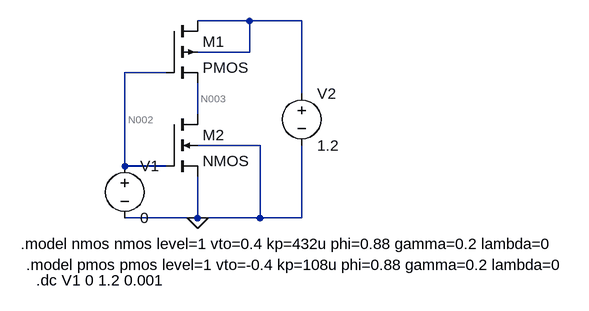
[diagram p0: schematic Lab03Pt4.asc]
Lab03Pt4.asc, the LTspice schematic file:
Version 4
SHEET 1 880 680
WIRE 272 -32 192 -32
WIRE 352 -32 272 -32
WIRE 272 16 272 -32
WIRE 272 16 192 16
WIRE 144 48 80 48
WIRE 352 80 352 -32
WIRE 192 112 192 64
WIRE 288 160 192 160
WIRE 80 192 80 48
WIRE 144 192 80 192
WIRE 192 272 192 208
WIRE 192 272 80 272
WIRE 288 272 288 160
WIRE 288 272 192 272
WIRE 352 272 352 160
WIRE 352 272 288 272
FLAG 192 272 0
SYMBOL voltage 80 176 R0
WINDOW 123 0 0 Left 0
WINDOW 39 0 0 Left 0
SYMATTR InstName V1
SYMATTR Value 0
SYMBOL voltage 352 64 R0
WINDOW 123 0 0 Left 0
WINDOW 39 0 0 Left 0
SYMATTR InstName V2
SYMATTR Value 1.2
SYMBOL pmos4 144 -32 R0
SYMATTR InstName M1
SYMATTR Value2 l=0.1u w=8u
SYMBOL nmos4 144 112 R0
SYMATTR InstName M2
SYMATTR Value2 l=0.1u w=2u
TEXT -80 312 Left 2 !.model nmos nmos level=1 vto=0.4 kp=432u phi=0.88 gamma=0.2 lambda=0
TEXT -72 344 Left 2 !.model pmos pmos level=1 vto=-0.4 kp=108u phi=0.88 gamma=0.2 lambda=0
TEXT -56 368 Left 2 !.dc V1 0 1.2 0.001

The netlist it stands for:
* Lab03Pt4.asc
V1 N002 0 0
V2 N001 0 1.2
M1 N001 N002 N003 N001 PMOS l=0.1u w=8u
M2 N003 N002 0 0 NMOS l=0.1u w=2u
.model NMOS NMOS
.model PMOS PMOS
.lib standard.mos
.model nmos nmos level=1 vto=0.4 kp=432u phi=0.88 gamma=0.2 lambda=0
.model pmos pmos level=1 vto=-0.4 kp=108u phi=0.88 gamma=0.2 lambda=0
.dc V1 0 1.2 0.001
.backanno
.end

* Results of the author's LTspice run, read from the files saved beside the schematic
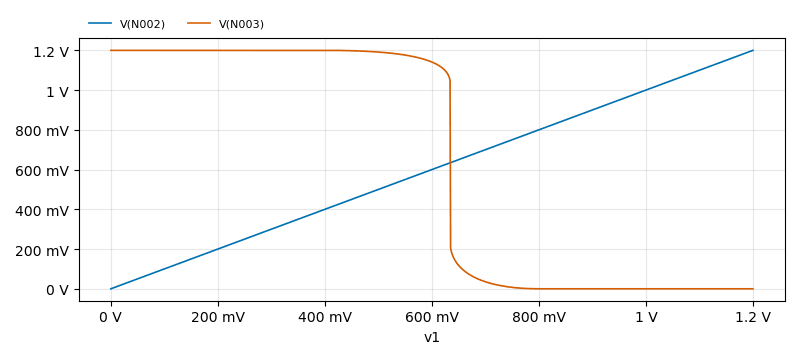
[diagram p1: DC transfer characteristic of Lab03Pt4.asc, plotted from the saved traces]
* DC transfer characteristic, 1 run:
*   V(N002): 0 V at v1=0 V, 1.2 V at v1=1.2 V, min 0 V, max 1.2 V
*   V(N003): 1.2 V at v1=0 V, 348.7 pV at v1=1.2 V, min 348.7 pV, max 1.2 V